# EAGLE design SO08-breakout (EAGLE 7.5.0)
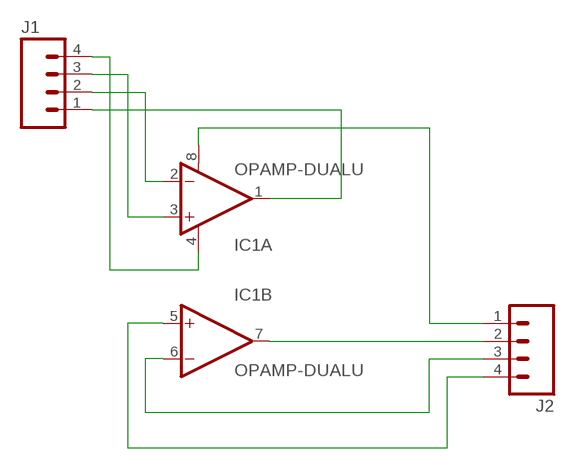
[diagram p0: schematic, sheet 1]

## Parts
IC1  OPAMP-DUALU  [SO08]
J1  M04PTH  [1X04]
J2  M04PTH  [1X04]

## Nets
1: IC1.1(A:OUT) J1.1
2: IC1.2(A:-IN) J1.2
3: IC1.3(A:+IN) J1.3
4: IC1.4(A:V-) J1.4
5: IC1.5(B:+IN) J2.4
6: IC1.6(B:-IN) J2.3
7: IC1.7(B:OUT) J2.2
8: IC1.8(A:V+) J2.1

## Library data of the parts
IC1 = SparkFun-AnalogIC:OPAMP-DUAL: Generic op-amp footprint
J1 J2 = SparkFun-Connectors:M04: Header 4 Standard 4-pin 0.1" header. Use with straight break away headers (SKU : PRT-00116), right angle break away headers (PRT-00553), swiss pins (PRT-00743), machine pins (PRT-00117), and female headers (PRT-00115). Molex polarized connector foot print use with SKU : PRT-08231 with associated crimp pins and housings. 1MM SMD Version SKU: PRT-10208; PROD_ID: CONN-09696

## Board
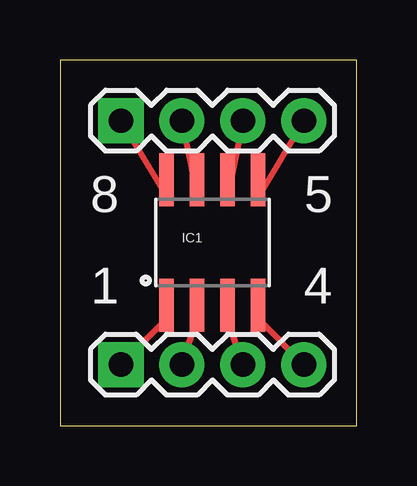
[diagram p1: board, top side]

Size 12.37 x 15.23 mm. Coordinates in mm from the lower left corner, seen from the top.
Outline: 0,0 12.37,0 12.37,15.23 0,15.23 0,0
Copper layers (1*16): Top 0.035mm / dielectric 1.5mm / Bottom 0.035mm
Design rules "default": minimum track width 10mil, minimum drill 24mil, track to track 8mil, track to pad 8mil, pad to pad 8mil, via to via 8mil, smd to smd 8mil, copper to edge 40mil, drill to drill 8mil, minimum pad ring 10mil, minimum via ring 8mil, stop-mask expansion 4mil, vias tented up to drill 0mil, thermal gap 10mil

### Footprints (pad centres in the part's own frame; a part is rotated, then mirrored left to right if it is on the bottom)
SO08 = smd 0.61 x 2.21: 1 -1.905,-2.616; 2 -0.635,-2.616; 3 0.635,-2.616; 4 1.905,-2.616; 5 1.905,2.616; 6 0.635,2.616; 7 -0.635,2.616; 8 -1.905,2.616
1X04 = drill 1.016 pad 1.88 square: 1 0,0 | drill 1.016 pad 1.88: 2 2.54,0; 3 5.08,0; 4 7.62,0

### Placement (x,y rotation side)
IC1  6.35,7.62 0 top
J1  2.54,2.54 0 top
J2  2.54,12.7 0 top

### Tracks (layer width: path | path; a pad name or v marks a point on that pad's centre or on a via)
1
  Top 0.254: J1.1 4.45,4.45 IC1.1
2
  Top 0.254: J1.2 5.71,4.45 IC1.2
3
  Top 0.254: J1.3 6.99,4.45 IC1.3
4
  Top 0.254: J1.4 8.26,4.45 IC1.4
5
  Top 0.254: J2.4 8.26,9.53 IC1.5
6
  Top 0.254: J2.3 6.99,9.53 IC1.6
7
  Top 0.254: J2.2 5.71,9.53 IC1.7
8
  Top 0.254: J2.1 4.45,9.53 IC1.8

### Text on the board
_tsilk: 8 | 5 | 1 | 4